# EAGLE schematic BNO055 IMU Board (EAGLE 9.6.2)
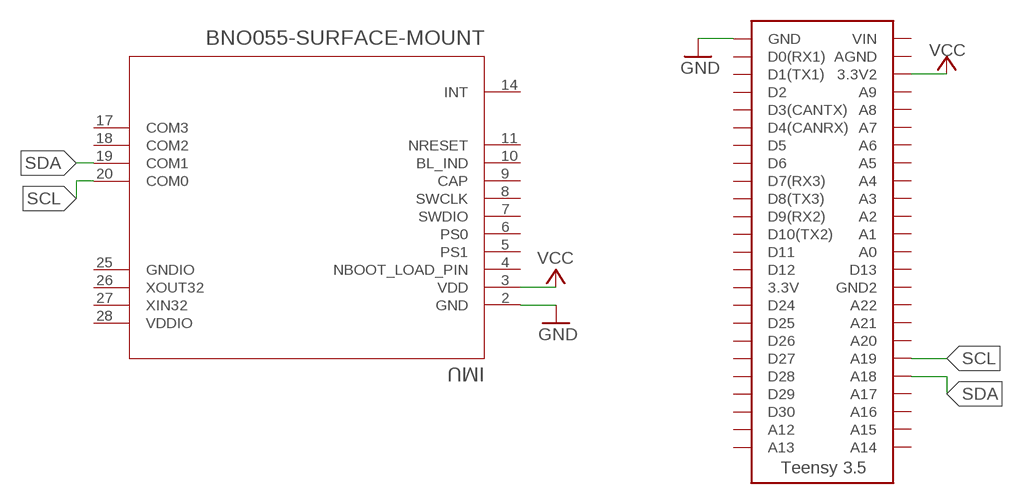
[diagram p0: schematic, sheet 1]

## Parts
IMU  BNO055-SURFACE-MOUNT  [QFN_BNO055_BOS]
U$1  TEENSY_3.5_SIMPLE  [TEENSY_3.5_SIMPLE]

## Nets
GND: IMU.2(GND) U$1.GND
SCL: IMU.20(COM0) U$1.A19
SDA: IMU.19(COM1) U$1.A18
VCC: IMU.3(VDD) U$1.3.3V2
Unconnected: IMU.4(NBOOT_LOAD_PIN) IMU.5(PS1) IMU.6(PS0) IMU.7(SWDIO) IMU.8(SWCLK) IMU.9(CAP) IMU.10(BL_IND) IMU.11(NRESET) IMU.14(INT) IMU.17(COM3) IMU.18(COM2) IMU.25(GNDIO) IMU.26(XOUT32) IMU.27(XIN32) U$1.3.3V U$1.A0 U$1.A1 U$1.A2 U$1.A3 U$1.A4 U$1.A5 U$1.A6 U$1.A7 U$1.A8 U$1.A9 U$1.A12 U$1.A13 U$1.A14 U$1.A15 U$1.A16 U$1.A17 U$1.A20 U$1.A21 U$1.A22 U$1.AGND U$1.D0(RX1) U$1.D1(TX1) U$1.D2 U$1.D3(CANTX) U$1.D4(CANRX) U$1.D5 U$1.D6 U$1.D7(RX3) U$1.D8(TX3) U$1.D9(RX2) U$1.D10(TX2) U$1.D11 U$1.D12 U$1.D13 U$1.D24 U$1.D25 U$1.D26 U$1.D27 U$1.D28 U$1.D29 U$1.D30 U$1.GND2 U$1.VIN

## Power pins joined to a net without a drawn wire
VDDIO: IMU.28(VDDIO)

## Library data of the parts
IMU = HyTechDevices:BNO055: 9-DOF IMU Quaternion Gravity Linear Acceleration Robust Heading Rotation See datasheet <https://cdn-shop.adafruit.com/datasheets/BST_BNO055_DS000_12.pdf>
U$1 = HyTechDevices:TEENSY_3.5_SIMPLE: Simple version of the Teensy 3.5 board that only uses the 2 main rows of pins, with no perpendicular row with VBat or inner pins.